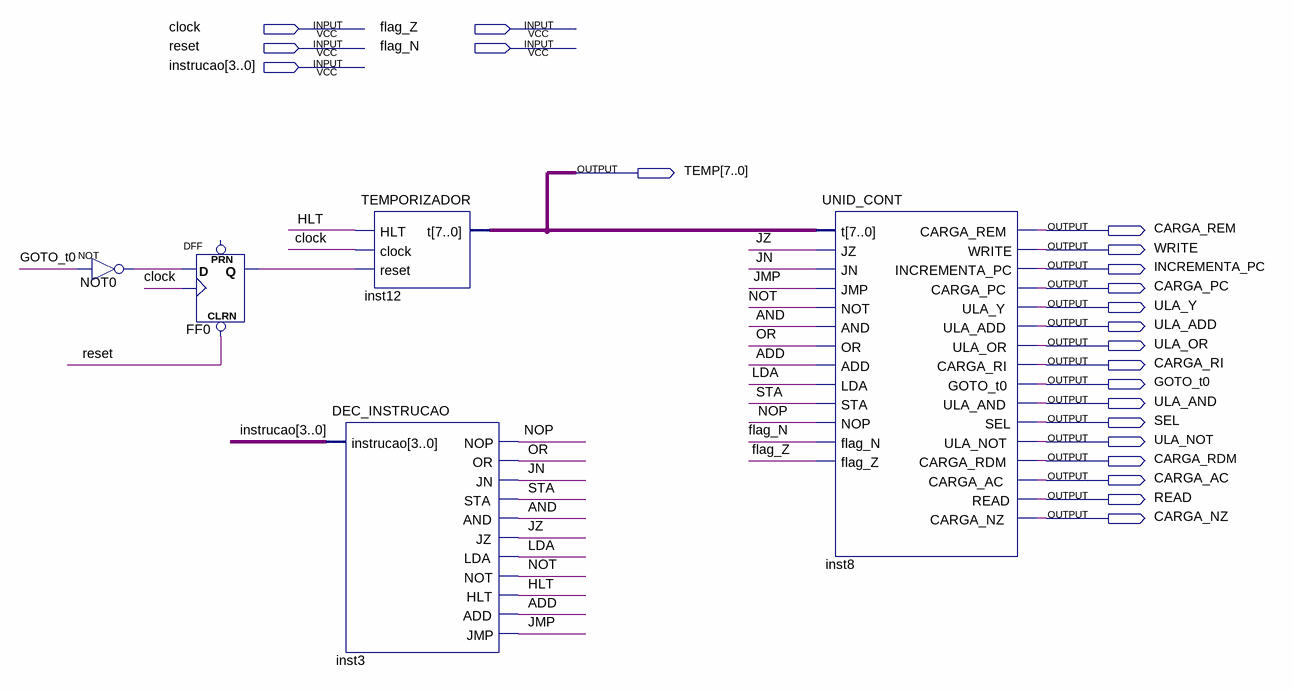
[diagram p0: schematic sheet]
// Quartus schematic UNIDADE_CONTROLE.bdf as structural Verilog: 5 symbols, 22 pins
module UNIDADE_CONTROLE (
  input  clock,
  input  flag_Z,
  input  reset,
  input  flag_N,
  input  [3:0] instrucao,
  output [7:0] TEMP,
  output CARGA_REM,
  output WRITE,
  output INCREMENTA_PC,
  output CARGA_PC,
  output ULA_Y,
  output ULA_ADD,
  output ULA_OR,
  output CARGA_RI,
  output GOTO_t0,
  output ULA_AND,
  output SEL,
  output ULA_NOT,
  output CARGA_RDM,
  output CARGA_AC,
  output READ,
  output CARGA_NZ
);

  wire ADD, AND, FF0_q, HLT, JMP, JN, JZ, LDA, NOP, NOT, NOT0_out, OR, STA;

  not NOT0 (NOT0_out, GOTO_t0);
  DFF FF0 (.CLRN(reset), .CLK(clock), .D(NOT0_out), .Q(FF0_q));  // open: PRN
  DEC_INSTRUCAO inst3 (
    .instrucao(instrucao), .NOP(NOP), .OR(OR), .JN(JN), .STA(STA), .AND(AND), .JZ(JZ), .LDA(LDA), .NOT(NOT),
    .HLT(HLT), .ADD(ADD), .JMP(JMP));
  TEMPORIZADOR inst12 (.HLT(HLT), .clock(clock), .reset(FF0_q), .t(TEMP));
  UNID_CONT inst8 (
    .t(TEMP), .JZ(JZ), .JN(JN), .JMP(JMP), .NOT(NOT), .AND(AND), .OR(OR), .ADD(ADD), .LDA(LDA), .STA(STA),
    .NOP(NOP), .flag_N(flag_N), .flag_Z(flag_Z), .CARGA_REM(CARGA_REM), .WRITE(WRITE),
    .INCREMENTA_PC(INCREMENTA_PC), .CARGA_PC(CARGA_PC), .ULA_Y(ULA_Y), .ULA_ADD(ULA_ADD), .ULA_OR(ULA_OR),
    .CARGA_RI(CARGA_RI), .GOTO_t0(GOTO_t0), .ULA_AND(ULA_AND), .SEL(SEL), .ULA_NOT(ULA_NOT),
    .CARGA_RDM(CARGA_RDM), .CARGA_AC(CARGA_AC), .READ(READ), .CARGA_NZ(CARGA_NZ));
endmodule
